# EasyEDA schematic 1-Schematic_1d Ping Pong.json
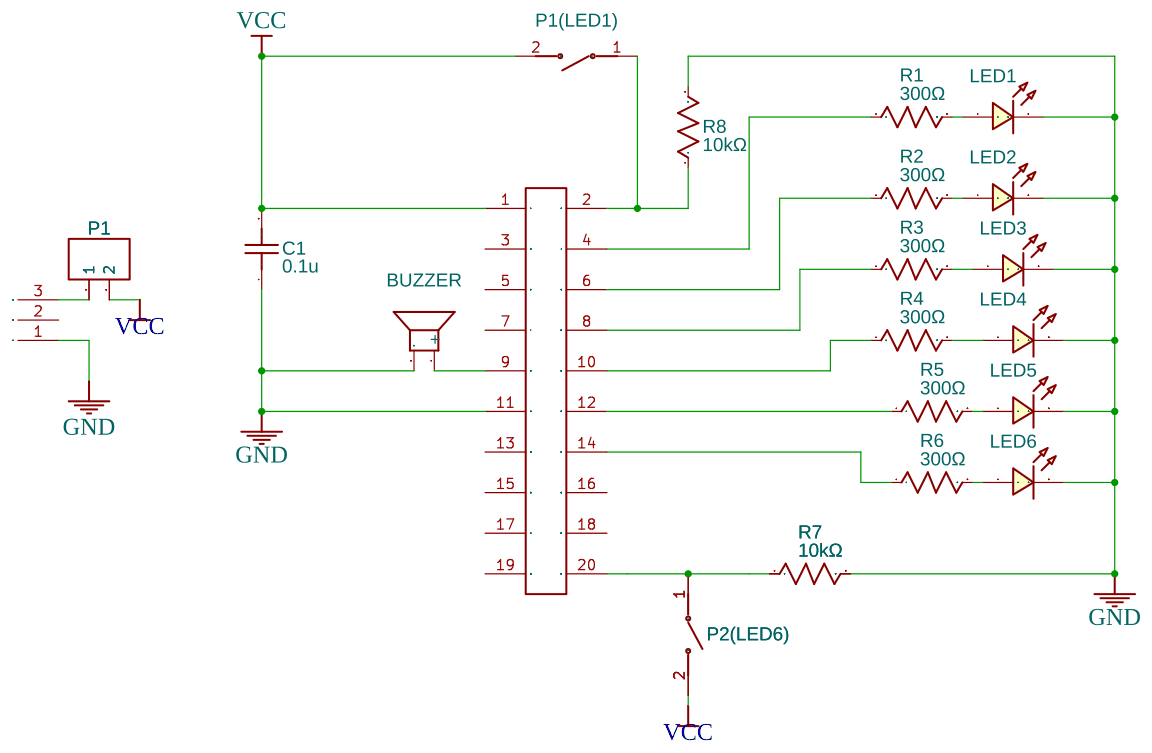
[diagram p0: schematic sheet]

## Parts
BUZZER  BUZZER-12X9  [BUZ-TH_BD12.0-P7.60-D0.6-FD]
C1  0.1u  [C0603]
LED1  LED-0603_R  [LED0603_RED]
LED2  LED-0603_R  [LED0603_RED]
LED3  LED-0603_R  [LED0603_RED]
LED4  LED-0603_R  [LED0603_RED]
LED5  LED-0603_R  [LED0603_RED]
LED6  LED-0603_R  [LED0603_RED]
P1  CONN-TH_2P-P5.00  [CONN-TH_2P-P5.00]
P1(LED1)  BUTTON  [SW-SMD_L3.9-W2.9-LS4.9-L]
P2(LED6)  BUTTON  [SW-SMD_L3.9-W2.9-LS4.9-L]
R1  300Ω  [R0603]
R2  300Ω  [R0603]
R3  300Ω  [R0603]
R4  300Ω  [R0603]
R5  300Ω  [R0603]
R6  300Ω  [R0603]
R7  10kΩ  [R0603]
R8  10kΩ  [R0603]
U1  Tumbler_Large  [TUMBLER_LARGE]
X1  PIN_HEADER_2x10  [PIN_HEADER_2X10]

## Library data of the parts
BUZZER = BUZZER-12X9: Contributor: lcsc; Supplier: LCSC; Supplier Part: C9900016920; Manufacturer: null; Manufacturer Part: buzzer-12X9
C1 = C_0603_US: Contributor: LCEDA_Lib
LED1-LED6 = LED-0603_R: Manufacturer: EVERLIGHT(台湾亿光); Manufacturer Part: 19-217/R6C-AL1M2VY/3T; Supplier Part: C72044; Supplier: LCSC; Contributor: LCEDA_01
P1 = CONN-TH_2P-P5.00: Supplier: LCSC; Contributor: LCEDA_Lib
P1(LED1) P2(LED6) = BUTTON: Contributor: lcsc; Supplier: LCSC; Supplier Part: C9900015607; Manufacturer: null; JLCPCB Part Class: Extended Part
R1-R8 = R_0603_US: Contributor: LCEDA_Lib
U1 = Tumbler_Large: Contributor: DKW_Projects
X1 = PIN_HEADER_2x10: Contributor: ajomay

## Nets
GND: BUZZER.2 C1.1 LED1.2 LED2.2 LED3.2 LED4.2 LED5.2 LED6.2 R7.2 R8.2 U1.1 X1.11
VCC: C1.2 P1.2 P1(LED1).2 P2(LED6).2 X1.1
Net-(BUZZER-1): BUZZER.1(+) X1.9
Net-(LED1-1): LED1.1 R1.2
Net-(LED2-1): LED2.1 R2.2
Net-(LED3-1): LED3.1 R3.2
Net-(LED4-1): LED4.1 R4.2
Net-(LED5-1): LED5.1 R5.2
Net-(LED6-1): LED6.1 R6.2
Net-(P1(LED1)-1): P1(LED1).1 R8.1 X1.2
Net-(P1-1): P1.1 U1.3
Net-(P2(LED6)-1): P2(LED6).1 R7.1 X1.20
Net-(R1-1): R1.1 X1.4
Net-(R2-1): R2.1 X1.6
Net-(R3-1): R3.1 X1.8
Net-(R4-1): R4.1 X1.10
Net-(R5-1): R5.1 X1.12
Net-(R6-1): R6.1 X1.14

Not connected (* = marked no-connect by the designer): U1 2; X1 3 5 7 13 15 16 17 18 19
